# EAGLE design ir_hid (EAGLE 5.00)
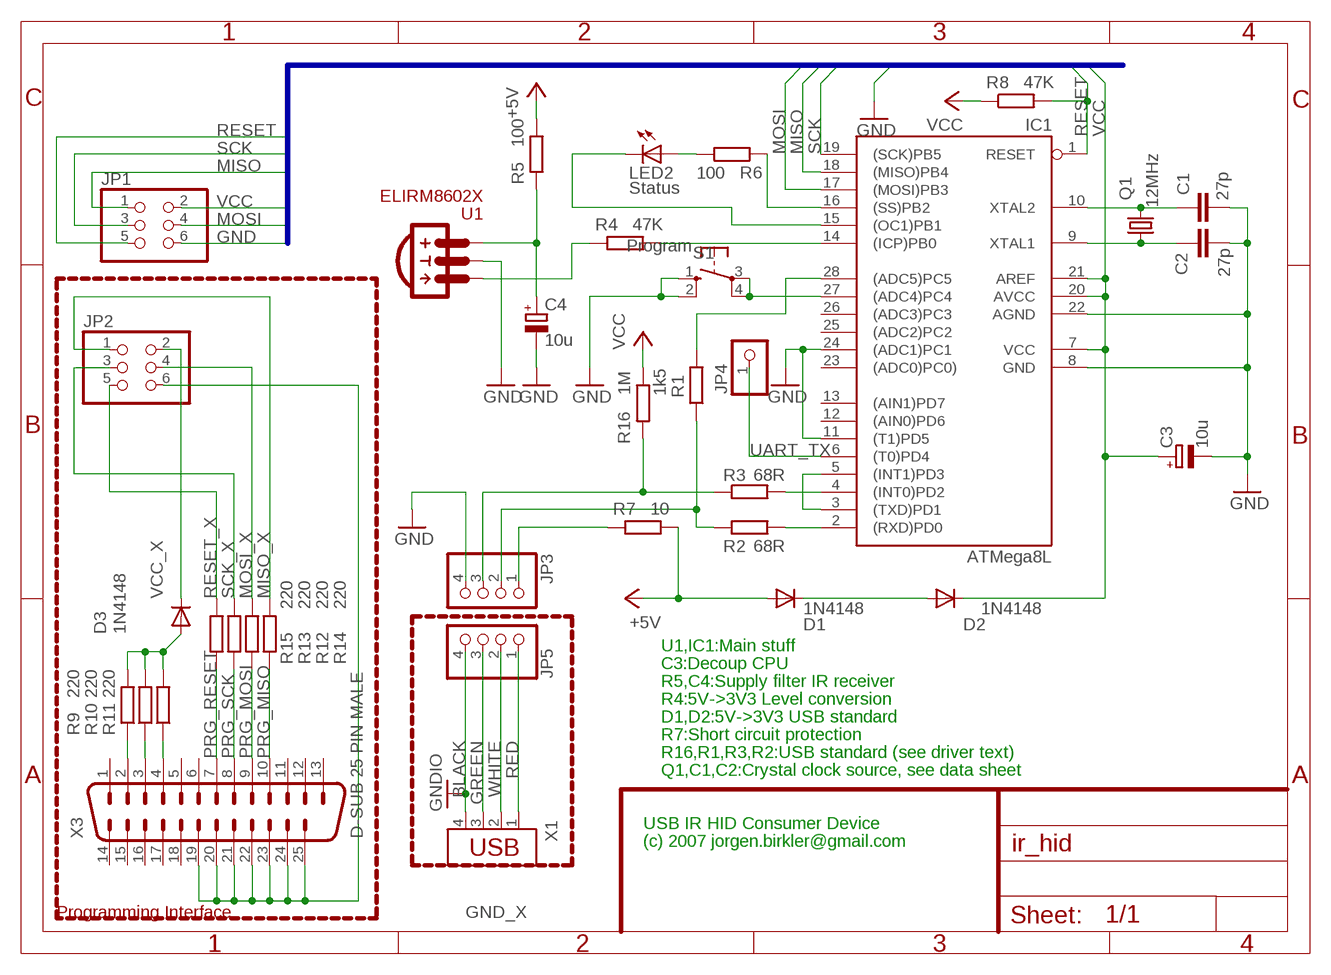
[diagram p0: schematic, sheet 1]

## Parts
C1  27p  C-EU025-024X044  [C025-024X044]
C2  27p  C-EU025-024X044  [C025-024X044]
C3  10u  CPOL-EUE2.5-5  [E2,5-5]
C4  10u  CPOL-EUE2.5-5  [E2,5-5]
D1  1N4148  [DO35-10]
D2  1N4148  [DO35-10]
D3  1N4148  [DO35-10]
IC1  ATMega8L  AT90S4433P  [DIL28-3]
JP1  PINHD-2X3  [2X03]
JP2  PINHD-2X3  [2X03]
JP3  PINHD-1X4  [1X04]
JP4  PINHD-1X1  [1X01]
JP5  PINHD-1X4  [1X04]
LED2  Status  LED3MM  [LED3MM]
Q1  12MHz  CRYTALHC49S  [HC49/S]
R1  1k5  R-EU_0207/7  [0207/7]
R2  68R  R-EU_0207/5V  [0207/5V]
R3  68R  R-EU_0207/2V  [0207/2V]
R4  47K  R-EU_0207/7  [0207/7]
R5  100  R-EU_0207/7  [0207/7]
R6  100  R-EU_0207/7  [0207/7]
R7  10  R-EU_0207/5V  [0207/5V]
R8  47K  R-EU_0207/7  [0207/7]
R9  220  R-EU_0207/7  [0207/7]
R10  220  R-EU_0207/7  [0207/7]
R11  220  R-EU_0207/7  [0207/7]
R12  220  R-EU_0207/7  [0207/7]
R13  220  R-EU_0207/7  [0207/7]
R14  220  R-EU_0207/7  [0207/7]
R15  220  R-EU_0207/7  [0207/7]
R16  1M  R-EU_0309/10  [0309/10]
S1  Program  10-XX  [B3F-10XX]
U1  ELIRM8602X  [ELIRM8608S-BENT]
X1  USB-787616  [USB]
X3  D-SUB 25 PIN MALE  M25H  [M25H]

## Nets
+4.4V: D1.C D2.A
+5V: D1.A R5.2 R7.2
_TX: IC1.3((TXD)PD1) IC1.5((INT1)PD3)
BLACK: JP5.4 X1.4 ; supply symbol labelled GNDIO
D+: JP3.3 R3.1 R16.2
D+_: IC1.4((INT0)PD2) R3.2
D-: JP3.2 R1.1 R2.1
D-_: IC1.2((RXD)PD0) R2.2
GND: C1.2 C2.2 C3.- C4.- IC1.8(GND) IC1.11((T1)PD5) IC1.22(AGND) IC1.24((ADC1)PC1) JP1.6 JP3.4 S1.1(S) S1.2(S1) U1.GND
GND_X: JP2.6 X3.19 X3.20 X3.21 X3.22 X3.23 X3.24 X3.25
GREEN: JP5.3 X1.3
IRRX_OUT: R4.1 U1.OUT
IRRX_OUT_CPU: IC1.14((ICP)PB0) R4.2
IRRX_POWER_FILT: C4.+ R5.1 U1.VS
LED+: IC1.16((SS)PB2) R6.1
LED+_: LED2.A R6.2
LED-: IC1.15((OC1)PB1) LED2.K(C)
MISO: IC1.18((MISO)PB4) JP1.1
MISO_X: JP2.1 R14.2
MOSI: IC1.17((MOSI)PB3) JP1.4
MOSI_X: JP2.4 R12.2
N$1: IC1.28((ADC5)PC5) R1.2
PRG_MISO: R14.1 X3.10
PRG_MOSI: R12.1 X3.9
PRG_POWER: D3.A R9.2 R10.2 R11.2
PRG_PWR1: R9.1 X3.2
PRG_PWR2: R10.1 X3.3
PRG_PWR3: R11.1 X3.4
PRG_RESET: R15.1 X3.7
PRG_SCK: R13.1 X3.8
PRG_SIG: IC1.27((ADC4)PC4) S1.3(P) S1.4(P1)
RED: JP5.1 X1.1
RESET: IC1.1(RESET) JP1.5 R8.2
RESET_X: JP2.5 R15.2
SCK: IC1.19((SCK)PB5) JP1.3
SCK_X: JP2.3 R13.2
UART_TX: IC1.6((T0)PD4) JP4.1
USB_POW: JP3.1 R7.1
VCC: C3.+ D2.C IC1.7(VCC) IC1.20(AVCC) IC1.21(AREF) JP1.2 R8.1 R16.1
VCC_X: D3.C JP2.2
WHITE: JP5.2 X1.2
XTAL1: C2.1 IC1.9(XTAL1) Q1.1
XTAL2: C1.1 IC1.10(XTAL2) Q1.2
Unconnected: IC1.12((AIN0)PD6) IC1.13((AIN1)PD7) IC1.23((ADC0)PC0)) IC1.25((ADC2)PC2) IC1.26((ADC3)PC3) X3.1 X3.5 X3.6 X3.11 X3.12 X3.13 X3.14 X3.15 X3.16 X3.17 X3.18

## Buses
B$1

## Notes on the sheet
- U1,IC1:Main stuff
- C3:Decoup CPU
- R5,C4:Supply filter IR receiver
- R4:5V->3V3 Level conversion
- D1,D2:5V->3V3 USB standard
- R7:Short circuit protection
- R16,R1,R3,R2:USB standard (see driver text)
- Q1,C1,C2:Crystal clock source, see data sheet
- USB IR HID Consumer Device
- (c) 2007 jorgen.birkler@gmail.com
- Programming Interface

## Library data of the parts
C1 C2 = rcl:C-EU: CAPACITOR, European symbol
C3 C4 = rcl:CPOL-EU: POLARIZED CAPACITOR, European symbol
D1-D3 = diode:1N4148: DIODE high speed (Philips)
IC1 = atmel:AT90S4433: MICROCONTROLLER 4 Kbytes FLASH 128 bytes SRAM 256 bytes EEPROM UART 6-channel 10 bit ADC
JP1 JP2 = pinhead:PINHD-2X3: PIN HEADER
JP3 JP5 = pinhead:PINHD-1X4: PIN HEADER
JP4 = pinhead:PINHD-1X1: PIN HEADER
LED2 = led:LED: LED OSRAM: - CHIPLED LG R971, LG N971, LY N971, LG Q971, LY Q971, LO R971, LY R971 LH N974, LH R974 LS Q976, LO Q976, LY Q976 LO Q996 - Hyper CHIPLED LW Q18S LB Q993, LB Q99A, LB R99A - SideLED LS A670, LO A670, LY A670, LG A670, LP A670 LB A673, LV A673, LT A673, LW A673 LH A674 LY A675 LS A676, LA A676, LO A676, LY A676, LW A676 LS A679, LY A679, LG A679 - Hyper Micro SIDELED® LS Y876, LA Y876, LO Y876, LY Y876 LT Y87S - SmartLED LW L88C, LW L88S LB L89C, LB L89S, LG L890 LS L89K, LO L89K, LY L89K LS L896, LA L896, LO L896, LY L896 - TOPLED LS T670, LO T670, LY T670, LG T670, LP T670 LSG T670, LSP T670, LSY T670, LOP T670, LYG T670 LG T671, LOG T671, LSG T671 LB T673, LV T673, LT T673, LW T673 LH T674 LS T676, LA T676, LO T676, LY T676, LB T676, LH T676, LSB T676, LW T676 LB T67C, LV T67C, LT T67C, LS T67K, LO T67K, LY T67K, LW E67C LS E67B, LA E67B, LO E67B, LY E67B, LB E67C, LV E67C, LT E67C LW T67C LS T679, LY T679, LG T679 LS T770, LO T770, LY T770, LG T770, LP T770 LB T773, LV T773, LT T773, LW T773 LH T774 LS E675, LA E675, LY E675, LS T675 LS T776, LA T776, LO T776, LY T776, LB T776 LHGB T686 LT T68C, LB T68C - Hyper Mini TOPLED® LB M676 - Mini TOPLED Santana® LG M470 LS M47K, LO M47K, LY M47K Source: http://www.osram.convergy.de - LUMILED® LXK2-PW12-R00, LXK2-PW12-S00, LXK2-PW14-U00, LXK2-PW14-V00 LXK2-PM12-R00, LXK2-PM12-S00, LXK2-PM14-U00 LXK2-PE12-Q00, LXK2-PE12-R00, LXK2-PE12-S00, LXK2-PE14-T00, LXK2-PE14-U00 LXK2-PB12-K00, LXK2-PB12-L00, LXK2-PB12-M00, LXK2-PB14-N00, LXK2-PB14-P00, LXK2-PB14-Q00 LXK2-PR12-L00, LXK2-PR12-M00, LXK2-PR14-Q00, LXK2-PR14-R00 LXK2-PD12-Q00, LXK2-PD12-R00, LXK2-PD12-S00 LXK2-PH12-R00, LXK2-PH12-S00 LXK2-PL12-P00, LXK2-PL12-Q00, LXK2-PL12-R00 Source: www.luxeon.com
Q1 = crystal:CRYTAL: CRYSTAL
R1-R16 = rcl:R-EU_: RESISTOR, European symbol
S1 = switch-omron:10-XX: OMRON SWITCH
U1 = elirm:ELIRM8602X: IR reciver module for 38KHz modulated 940nm Ir-light
X1 = con-amp:USB-787616: AMP connector
X3 = con-subd:M25: SUB-D

## Board
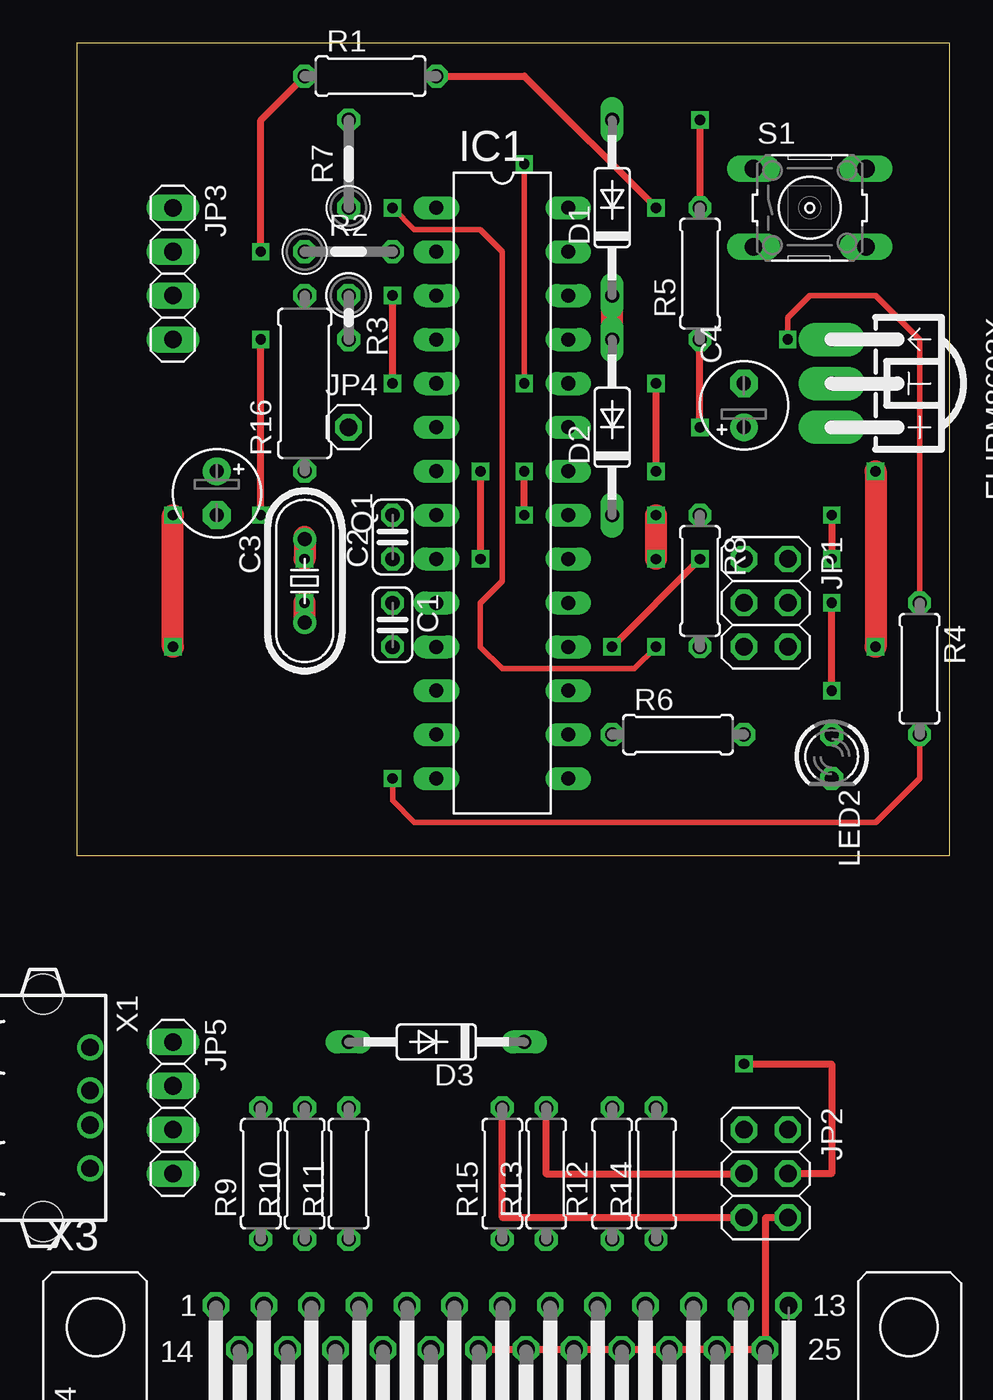
[diagram p1: board, top side]
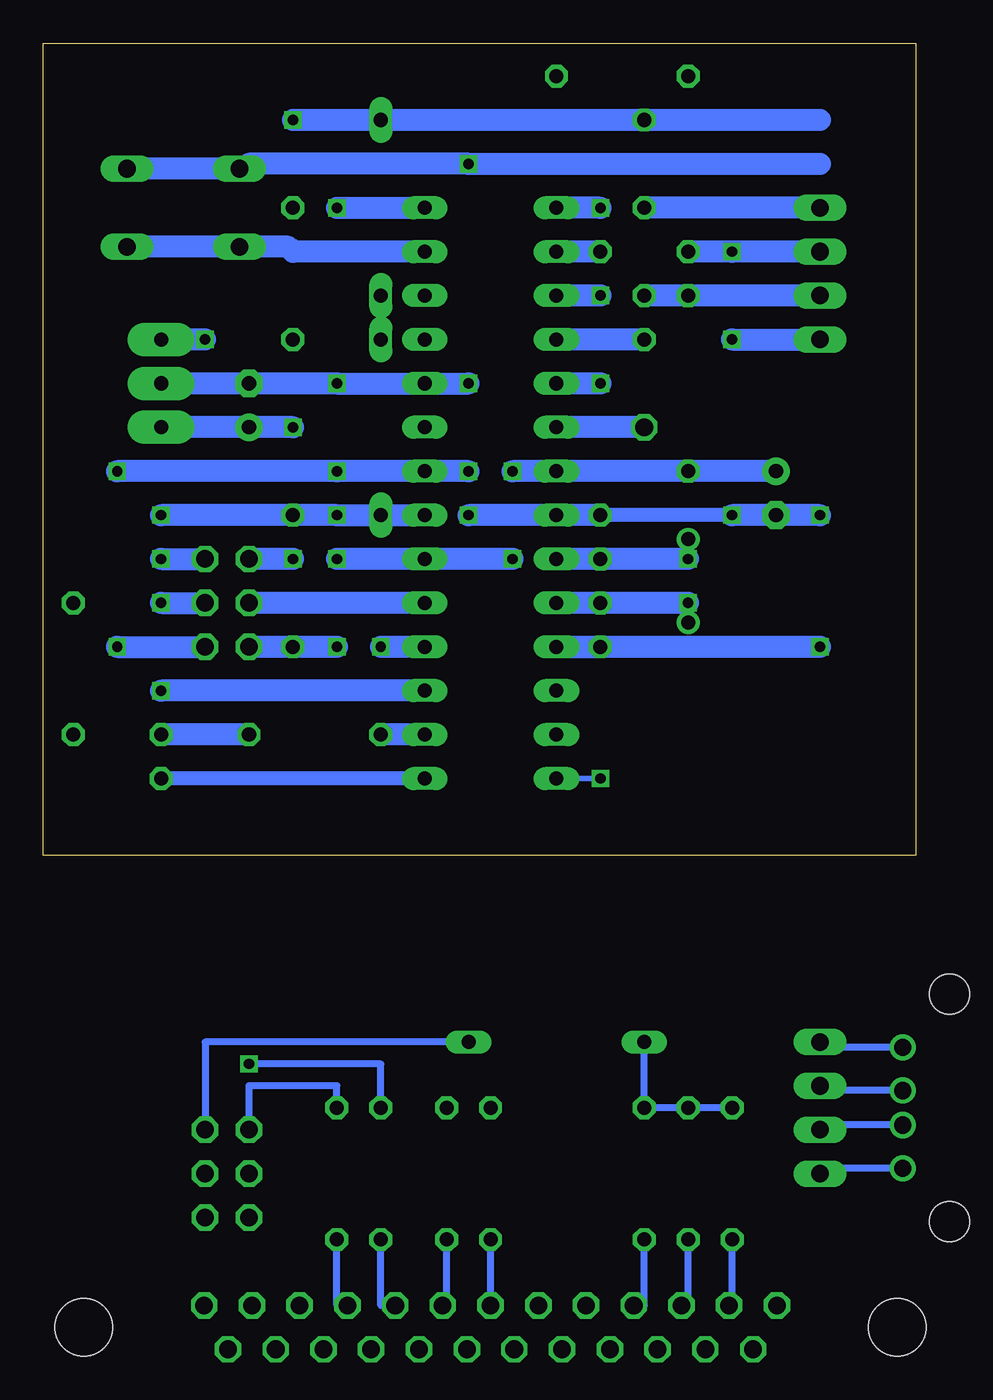
[diagram p2: board, bottom side, seen from below]

Size 50.47 x 46.98 mm. Coordinates in mm from the lower left corner, seen from the top.
Outline: 0,0 50.47,0 50.47,46.98 0,46.98 0,0
Copper layers (1*16): Top 0.035mm / dielectric 1.5mm / Bottom 0.035mm
Design rules "default": minimum track width 10mil, minimum drill 12mil, track to track 8mil, track to pad 8mil, pad to pad 8mil, via to via 8mil, smd to smd 8mil, copper to edge 40mil, drill to drill 8mil, minimum pad ring 10mil, minimum via ring 8mil, stop-mask expansion 4mil, vias tented up to drill 0mil, thermal gap 10mil

### Footprints (pad centres in the part's own frame; a part is rotated, then mirrored left to right if it is on the bottom)
C025-024X044 = drill 0.813 octagon: 1 -1.27,0; 2 1.27,0
E2,5-5 = drill 0.813 pad 1.6 round: + -1.27,0 | drill 0.813 pad 1.6 octagon: - 1.27,0
DO35-10 = drill 0.813 long: A 5.08,0; C -5.08,0
DIL28-3 = drill 0.813 long: 1 -16.51,-3.81; 2 -13.97,-3.81; 3 -11.43,-3.81; 4 -8.89,-3.81; 5 -6.35,-3.81; 6 -3.81,-3.81; 7 -1.27,-3.81; 8 1.27,-3.81; 9 3.81,-3.81; 10 6.35,-3.81; 11 8.89,-3.81; 12 11.43,-3.81; 13 13.97,-3.81; 14 16.51,-3.81; 15 16.51,3.81; 16 13.97,3.81; 17 11.43,3.81; 18 8.89,3.81; 19 6.35,3.81; 20 3.81,3.81; 21 1.27,3.81; 22 -1.27,3.81; 23 -3.81,3.81; 24 -6.35,3.81; 25 -8.89,3.81; 26 -11.43,3.81; 27 -13.97,3.81; 28 -16.51,3.81
2X03 = drill 1.016 octagon: 1 -2.54,-1.27; 2 -2.54,1.27; 3 0,-1.27; 4 0,1.27; 5 2.54,-1.27; 6 2.54,1.27
1X04 = drill 1.016 long: 1 -3.81,0; 2 -1.27,0; 3 1.27,0; 4 3.81,0
1X01 = drill 1.016 octagon: 1 0,0
LED3MM = drill 0.813 octagon: A -1.27,0; K 1.27,0
HC49/S = drill 0.813 round: 1 -2.413,0; 2 2.413,0
0207/7 = drill 0.813 octagon: 1 -3.81,0; 2 3.81,0
0207/5V = drill 0.813 octagon: 1 -2.54,0; 2 2.54,0
0207/2V = drill 0.813 octagon: 1 -1.27,0; 2 1.27,0
0309/10 = drill 0.813 octagon: 1 -5.08,0; 2 5.08,0
B3F-10XX = drill 1.016 long: 1 -3.251,2.261; 2 3.251,2.261; 3 -3.251,-2.261; 4 3.251,-2.261
ELIRM8608S-BENT = drill 0.813 pad 1.93 long: GND -3.81,-2.54; OUT -6.35,-2.54; VS -1.27,-2.54
USB = drill 1 round: 1 -3.5,12.99; 2 -1,12.99; 3 1,12.99; 4 3.5,12.99 | hole 2.3: -6.57,10.28; 6.57,10.28
M25H = drill 1.016 octagon: 1 -16.561,1.27; 2 -13.792,1.27; 3 -11.049,1.27; 4 -8.28,1.27; 5 -5.512,1.27; 6 -2.769,1.27; 7 0,1.27; 8 2.769,1.27; 9 5.512,1.27; 10 8.28,1.27; 11 11.049,1.27; 12 13.792,1.27; 13 16.561,1.27; 14 -15.189,-1.27; 15 -12.421,-1.27; 16 -9.652,-1.27; 17 -6.909,-1.27; 18 -4.14,-1.27; 19 -1.372,-1.27; 20 1.372,-1.27; 21 4.14,-1.27; 22 6.909,-1.27; 23 9.652,-1.27; 24 12.421,-1.27; 25 15.189,-1.27 | hole 3.302: 23.52,0; -23.52,0

### Placement (x,y rotation side)
C1  18.25,13.33 270 top
C2  18.25,18.41 90 top
C3  8.09,20.95 270 top
C4  38.57,26.03 90 top
D1  30.95,37.46 90 top
D2  30.95,24.76 90 top
D3  20.79,-10.8 180 top  (outside the outline)
IC1  24.6,20.95 270 top
JP1  39.84,14.6 270 top
JP2  39.84,-18.42 270 top  (outside the outline)
JP3  5.55,33.65 270 top
JP4  15.71,24.76 0 top
JP5  5.55,-14.61 270 top  (outside the outline)
LED2  43.65,5.71 270 top
Q1  13.17,15.87 270 top
R1  16.98,45.08 0 top
R2  15.71,34.92 0 top
R3  15.71,31.11 270 top
R4  48.73,10.79 270 top
R5  36.03,33.65 90 top
R6  34.76,6.98 0 top
R7  15.71,40 90 top
R8  36.03,15.87 270 top
R9  10.63,-18.42 90 top  (outside the outline)
R10  13.17,-18.42 90 top  (outside the outline)
R11  15.71,-18.42 90 top  (outside the outline)
R12  30.95,-18.42 90 top  (outside the outline)
R13  27.14,-18.42 90 top  (outside the outline)
R14  33.49,-18.42 90 top  (outside the outline)
R15  24.6,-18.42 90 top  (outside the outline)
R16  13.17,27.3 90 top
S1  42.38,37.46 0 top
U1  46.19,23.49 270 top
X1  -12.23,-14.61 270 top  (outside the outline)
X3  24.6,-27.31 0 top  (outside the outline)

### Tracks (layer width: path | path; a pad name or v marks a point on that pad's centre or on a via)
+4.4V
  Top 1.27: D2.A D1.C
+5V  (via drill 0.6)
  Top 0.406: v36.03,42.54 R5.2
  Bottom 1.27: v36.03,42.54 D1.A R7.2 5.55,42.54
_TX  (via drill 0.6)
  Top 0.406: v18.25,27.3 v18.25,32.38
  Bottom 1.27: v18.25,32.38 IC1.3 | v18.25,27.3 IC1.5
BLACK
  Bottom 0.406: X1.4 5.55,-18.11 JP5.4
D+
  Bottom 1.27: JP3.3 R16.2 R3.1
D+_
  Bottom 1.27: R3.2 IC1.4
D-  (via drill 0.6)
  Top 0.406: v10.63,34.92 10.63,42.54 R1.1
  Bottom 1.27: JP3.2 v10.63,34.92 | v10.63,34.92 R2.1 v10.63,34.92
D-_
  Bottom 1.27: R2.2 IC1.2
GND  (via drill 0.6)
  Top 0.305: v25.87,27.3 v25.87,40
  Top 0.406: v10.63,19.68 v10.63,29.84 | v33.49,22.22 v33.49,27.3 | v25.87,19.68 v25.87,22.22
  Top 1.27: v5.55,12.06 v5.55,19.68 | v46.19,22.22 v46.19,12.06
  Bottom 0.305: C2.2 IC1.8
  Bottom 0.813: v10.63,19.68 C2.2
  Bottom 1.27: C2.2 IC1.8 v25.87,19.68 | v10.63,29.84 JP3.4 | U1.GND C4.- v33.49,27.3 IC1.24 v25.87,27.3 | v25.87,22.22 IC1.22 v33.49,22.22 v46.19,22.22 | v46.19,12.06 JP1.6 | v5.55,19.68 C3.- | C3.- v10.63,19.68 C3.- | S1.2 S1.1 38.85,39.72 38.57,40 v25.87,40 5.55,40 | C1.2 IC1.11 v5.55,12.06
GND_X
  Top 0.406: JP2.6 39.84,-20.96 39.84,-28.58 X3.25 X3.24 | X3.24 36.03,-28.58 | X3.24 X3.23 X3.22 | X3.22 30.95,-28.58 | X3.22 X3.21 X3.20 | X3.20 25.87,-28.58 | X3.19 X3.20
GREEN
  Bottom 0.406: X1.3 5.55,-15.61 JP5.3
IRRX_OUT  (via drill 0.6)
  Top 0.305: R4.1 48.73,29.84 46.19,32.38 42.38,32.38 41.11,31.11 v41.11,29.84
  Bottom 1.27: v41.11,29.84 U1.OUT
IRRX_OUT_CPU  (via drill 0.6)
  Top 0.305: R4.2 48.73,4.44 46.19,1.9 19.52,1.9 18.25,3.17 v18.25,4.44
  Bottom 0.305: v18.25,4.44 IC1.14
IRRX_POWER_FILT  (via drill 0.6)
  Top 0.406: v36.03,24.76 R5.1
  Bottom 0.406: v36.03,24.76 C4.+
  Bottom 1.27: v36.03,24.76 C4.+ U1.VS
LED+
  Bottom 1.27: IC1.16 R6.1
LED+_
  Bottom 1.27: R6.2 LED2.A
LED-
  Bottom 0.813: IC1.15 LED2.K
MISO  (via drill 0.6)
  Top 0.406: v30.95,12.06 v36.03,17.14
  Bottom 1.27: v36.03,17.14 JP1.1 | IC1.18 v30.95,12.06
MISO_X
  Bottom 0.406: JP2.1 38.57,-13.34 33.49,-13.34 R14.2
MOSI  (via drill 0.6)
  Top 0.406: v43.65,9.52 v43.65,14.6
  Bottom 1.27: IC1.17 v43.65,9.52 | v43.65,14.6 JP1.4
MOSI_X  (via drill 0.6)
  Top 0.406: v38.57,-12.07 43.65,-12.07 43.65,-18.42 JP2.4
  Bottom 0.406: R12.2 30.95,-12.07 v38.57,-12.07
N$1  (via drill 0.6)
  Top 0.406: v33.49,37.46 25.87,45.08 R1.2
  Bottom 1.27: v33.49,37.46 IC1.28
PRG_MISO
  Bottom 0.406: X3.10 33.49,-26.04 R14.1
PRG_MOSI
  Bottom 0.406: X3.9 30.95,-26.04 R12.1
PRG_POWER
  Bottom 0.406: R9.2 R10.2 R11.2 D3.A
PRG_PWR1
  Bottom 0.406: X3.2 10.63,-26.04 R9.1
PRG_PWR2
  Bottom 0.406: X3.3 13.17,-26.04 R10.1
PRG_PWR3
  Bottom 0.406: X3.4 15.71,-26.04 R11.1
PRG_RESET
  Bottom 0.406: X3.7 R15.1
PRG_SCK
  Bottom 0.406: X3.8 27.14,-26.04 R13.1
PRG_SIG
  Bottom 1.27: IC1.27 36.03,34.92 36.31,35.2 | 36.31,35.2 S1.3 | 36.31,35.2 S1.4
RED
  Bottom 0.406: X1.1 5.55,-11.11 JP5.1
RESET  (via drill 0.6)
  Top 0.305: v33.49,12.06 32.22,10.79 24.6,10.79 23.33,12.06 23.33,14.6 24.6,15.87 24.6,34.92 23.33,36.19 19.52,36.19 v18.25,37.46
  Bottom 1.27: JP1.5 R8.2 v33.49,12.06 | v18.25,37.46 IC1.1
RESET_X
  Top 0.406: JP2.5 24.6,-20.96 R15.2
SCK
  Bottom 1.27: IC1.19 JP1.3
SCK_X
  Top 0.406: JP2.3 27.14,-18.42 R13.2
UART_TX
  Bottom 1.27: JP4.1 IC1.6
USB_POW
  Bottom 1.27: JP3.1 R7.1
VCC  (via drill 0.6)
  Top 0.406: v43.65,19.68 v43.65,17.14 | v23.33,22.22 v23.33,17.14
  Top 1.27: v33.49,17.14 v33.49,19.68
  Bottom 1.27: D2.C IC1.21 | v33.49,19.68 D2.C | v33.49,19.68 R8.1 | R8.1 v43.65,19.68 | v33.49,19.68 D2.C | v33.49,19.68 R8.1 | C3.+ R16.1 IC1.7 v23.33,22.22 | v23.33,17.14 IC1.20 v33.49,17.14 | v33.49,19.68 D2.C | v43.65,17.14 JP1.2 v43.65,17.14
VCC_X
  Bottom 0.406: D3.C 41.11,-10.8 JP2.2
WHITE
  Bottom 0.406: X1.2 5.55,-13.61 JP5.2
XTAL1  (via drill 0.6)
  Top 1.27: 13.17,18.41 Q1.1 v13.17,17.14
  Bottom 1.27: v13.17,17.14 C2.1 | C2.1 IC1.9 C2.1
XTAL2  (via drill 0.6)
  Top 1.27: Q1.2 v13.17,14.6 Q1.2
  Bottom 1.27: IC1.10 C1.1 v13.17,14.6